# Altium schematic sheet ZOWI_Main_Board_Bluetooth.SchDoc: Bluetooth
size A3; Author: Raúl de Pablos; CompanyName: bq - Mundo Reader; Organization: bq - Mundo Reader; DocumentNumber: 7; Revision: 1.0; SheetNumber: 7; SheetTotal: 9; ProjectName: ZOWI_Main_Board
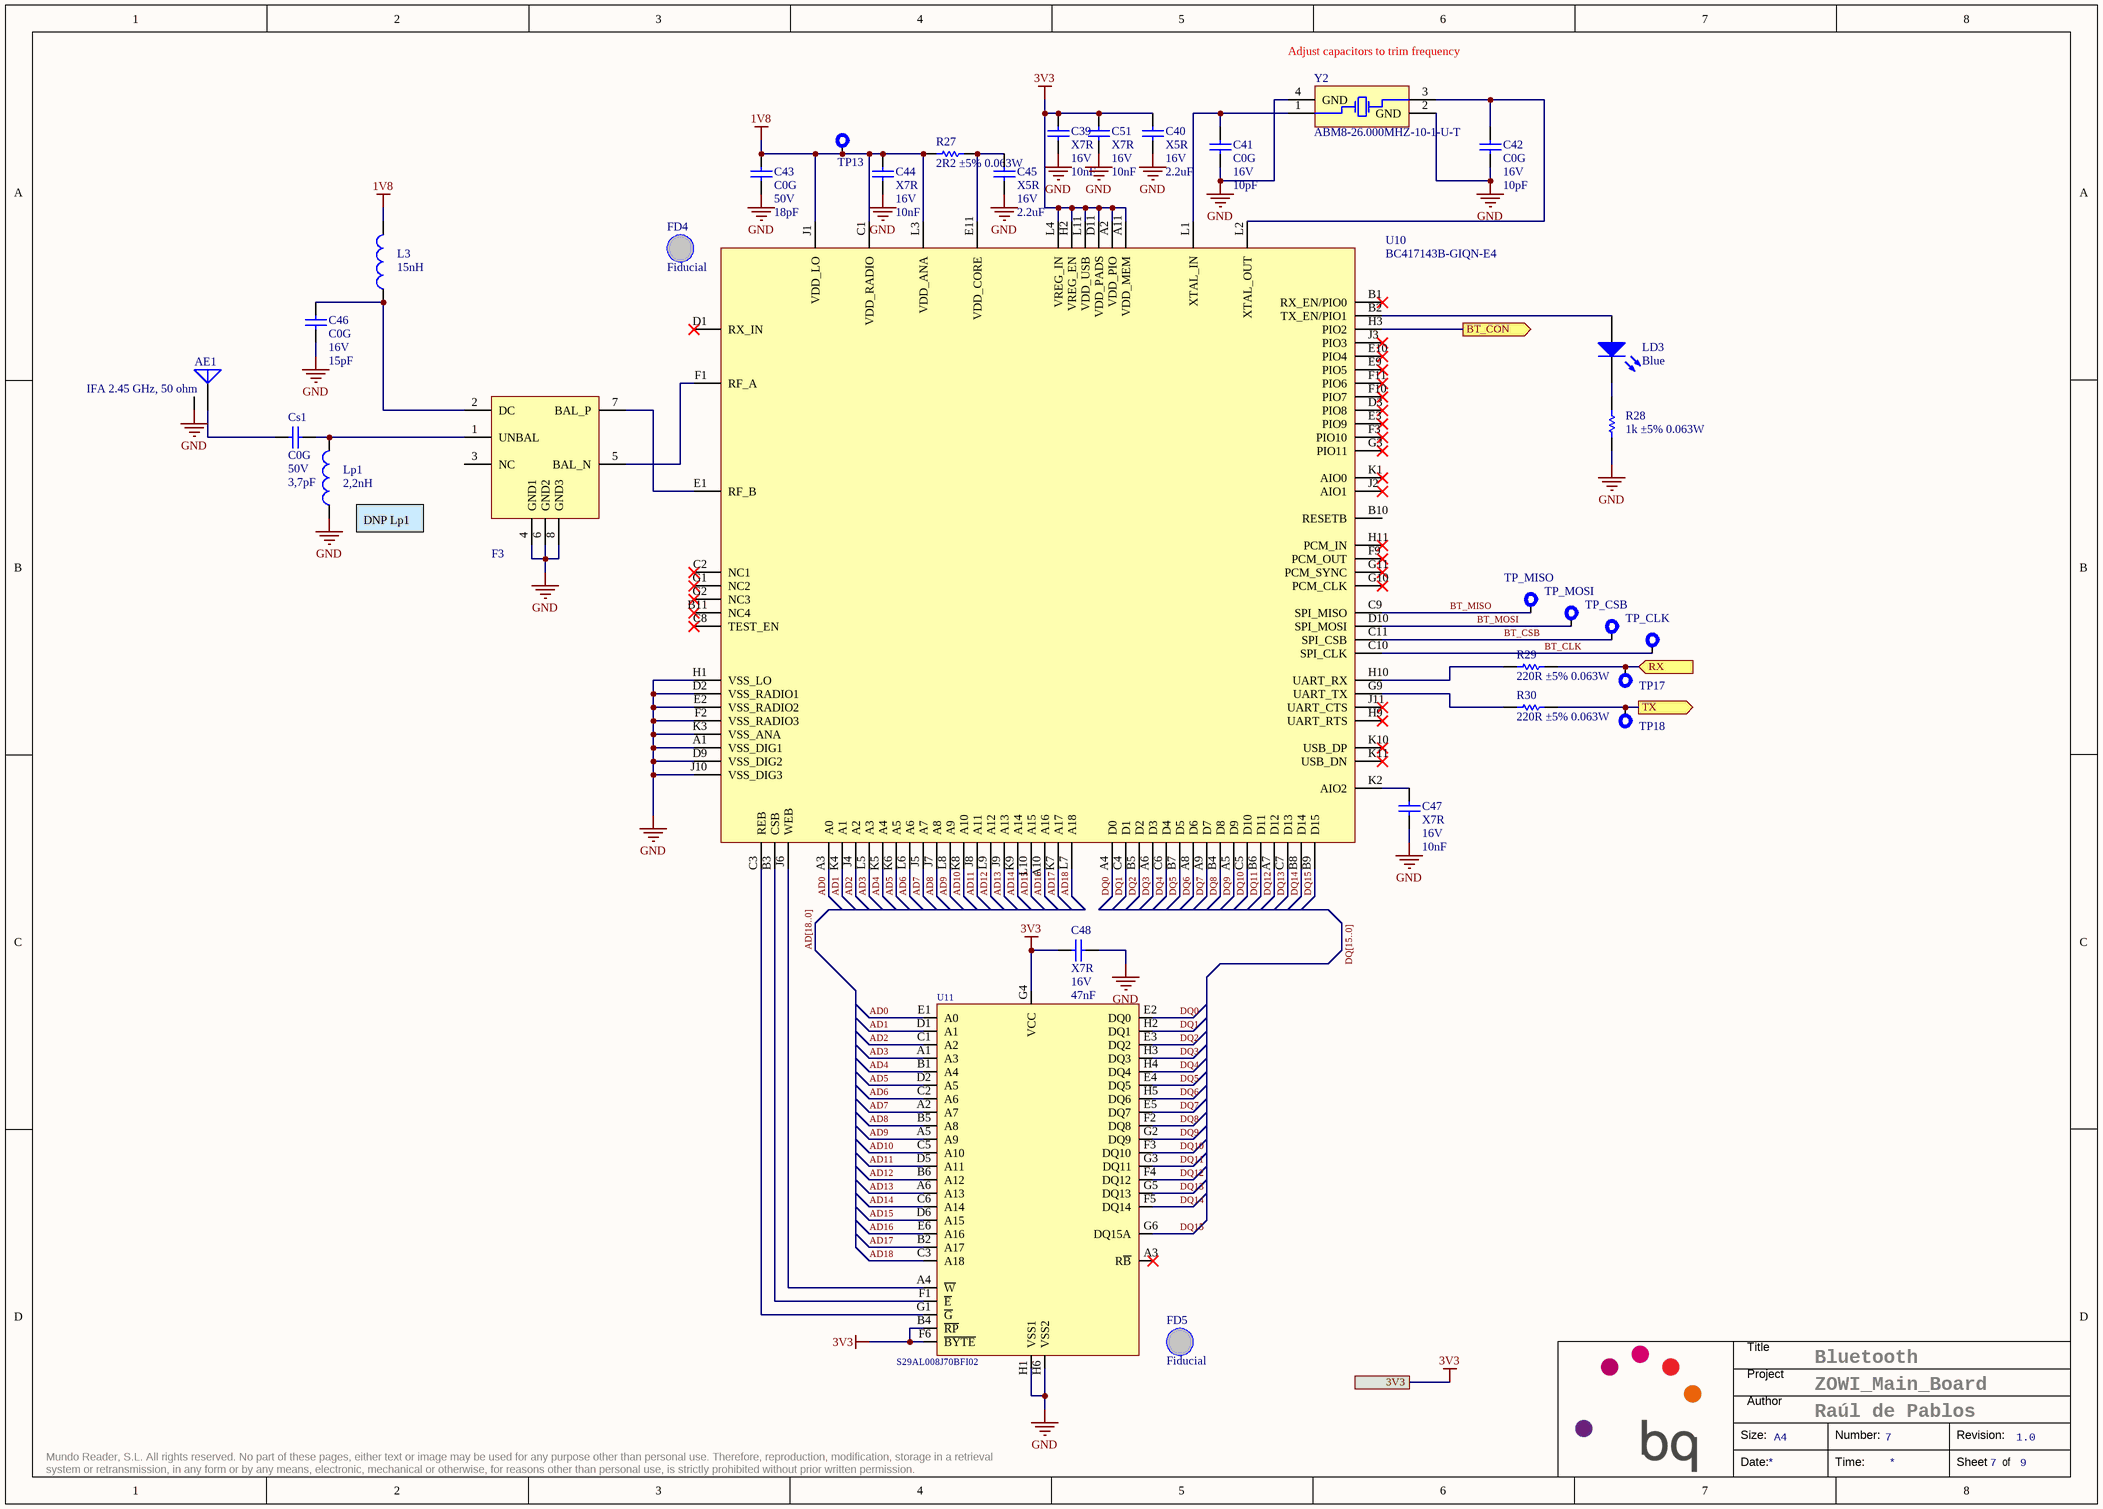
[diagram p0: ZOWI_Main_Board_Bluetooth.SchDoc]

## Parts
AE1  (no value)  [IFA_2,45GHZ_50OHM]  (no BOM)
C39  Dielectric: X7R  Voltage: 16V  Capacitance: 10nF  [C0402]  (hidden comment: Capacitor)
C40  Dielectric: X5R  Voltage: 16V  Capacitance: 2.2uF  [C0603]  (hidden comment: Capacitor)
C41  Dielectric: C0G  Voltage: 16V  Capacitance: 10pF  [C0402]  (hidden comment: Capacitor)
C42  Dielectric: C0G  Voltage: 16V  Capacitance: 10pF  [C0402]  (hidden comment: Capacitor)
C43  Dielectric: C0G  Voltage: 50V  Capacitance: 18pF  [C0402]  (hidden comment: Capacitor)
C44  Dielectric: X7R  Voltage: 16V  Capacitance: 10nF  [C0402]  (hidden comment: Capacitor)
C45  Dielectric: X5R  Voltage: 16V  Capacitance: 2.2uF  [C0603]  (hidden comment: Capacitor)
C46  Dielectric: C0G  Voltage: 16V  Capacitance: 15pF  [C0402]  (hidden comment: Capacitor)
C47  Dielectric: X7R  Voltage: 16V  Capacitance: 10nF  [C0402]  (hidden comment: Capacitor)
C48  Dielectric: X7R  Voltage: 16V  Capacitance: 47nF  [C0402]  (hidden comment: Capacitor)
C51  Dielectric: X7R  Voltage: 16V  Capacitance: 10nF  [C0402]  (hidden comment: Capacitor)
Cs1  Dielectric: C0G  Voltage: 50V  Capacitance: 3,7pF  [C0402]  (hidden comment: Capacitor)
F3  BP_Filter_Balun  [2450FB15K0005]  (value not drawn)
FD4  Fiducial  [Fiducial_Local_0.4mm]  (no BOM)
FD5  Fiducial  [Fiducial_Local_0.4mm]  (no BOM)
L3  L: 15nH  [L0402]
LD3  Blue  [LED0603]
Lp1  L: 2,2nH  [L0402]  (no BOM)
R27  value 2R2 ±5% 0.063W  [R0402]  (hidden comment: Resistor)
R28  value 1k ±5% 0.063W  [R0402]  (hidden comment: Resistor)
R29  value 220R ±5% 0.063W  [R0402]  (hidden comment: Resistor)
R30  value 220R ±5% 0.063W  [R0402]  (hidden comment: Resistor)
TP13  Testpoint  [TP_SMD_1mm]  (value not drawn)  (no BOM)
TP17  Testpoint  [TP_SMD_1mm]  (value not drawn)  (no BOM)
TP18  Testpoint  [TP_SMD_1mm]  (value not drawn)  (no BOM)
TP_CLK  Testpoint  [TP_SMD_1mm]  (value not drawn)  (no BOM)
TP_CSB  Testpoint  [TP_SMD_1mm]  (value not drawn)  (no BOM)
TP_MISO  Testpoint  [TP_SMD_1mm]  (value not drawn)  (no BOM)
TP_MOSI  Testpoint  [TP_SMD_1mm]  (value not drawn)  (no BOM)
U10  BC417143B-GIQN-E4  [TFBGA96P8X8]
U11  S29AL008J70BFI02  [TFBGA48P6X8]
Y2  ABM8-26.000MHZ-10-1-U-T  [XTAL 3.2x2.5]

## Ports
3V3, BT_CON (out), RX (in), TX (out)

## Nets
1V8: C43.2 C44.2 L3.2 R27.2 TP13.1 U10.C1(VDD_RADIO) U10.J1(VDD_LO) U10.L3(VDD_ANA)
3V3: C39.2 C40.2 C48.1 C51.2 U10.A2(VDD_PIO) U10.A11(VDD_MEM) U10.D11(VDD_PADS) U10.H2(VREG_EN) U10.L4(VREG_IN) U10.L11(VDD_USB) U11.B4(~{RP}) U11.F6(~{BYTE}) U11.G4(VCC) ; port 3V3
GND: AE1.GND C39.1 C40.1 C41.1 C42.1 C43.1 C44.1 C45.1 C46.1 C47.1 C48.2 C51.1 F3.4(GND1) F3.6(GND2) F3.8(GND3) Lp1.1 R28.1 U10.A1(VSS_DIG1) U10.D2(VSS_RADIO1) U10.D9(VSS_DIG2) U10.E2(VSS_RADIO2) U10.F2(VSS_RADIO3) U10.H1(VSS_LO) U10.J10(VSS_DIG3) U10.K3(VSS_ANA) U11.H1(VSS1) U11.H6(VSS2) Y2.2(GND) Y2.4(GND)
AD0: U10.A3(A0) U11.E1(A0)
AD1: U10.K4(A1) U11.D1(A1)
AD2: U10.J4(A2) U11.C1(A2)
AD3: U10.L5(A3) U11.A1(A3)
AD4: U10.K5(A4) U11.B1(A4)
AD5: U10.K6(A5) U11.D2(A5)
AD6: U10.L6(A6) U11.C2(A6)
AD7: U10.J5(A7) U11.A2(A7)
AD8: U10.J7(A8) U11.B5(A8)
AD9: U10.L8(A9) U11.A5(A9)
AD10: U10.K8(A10) U11.C5(A10)
AD11: U10.J8(A11) U11.D5(A11)
AD12: U10.L9(A12) U11.B6(A12)
AD13: U10.J9(A13) U11.A6(A13)
AD14: U10.K9(A14) U11.C6(A14)
AD15: U10.L10(A15) U11.D6(A15)
AD16: U10.A10(A16) U11.E6(A16)
AD17: U10.K7(A17) U11.B2(A17)
AD18: U10.L7(A18) U11.C3(A18)
BT_CLK: TP_CLK.1 U10.C10(SPI_CLK)
BT_CON: U10.H3(PIO2) ; port BT_CON
BT_CSB: TP_CSB.1 U10.C11(SPI_CSB)
BT_MISO: TP_MISO.1 U10.C9(SPI_MISO)
BT_MOSI: TP_MOSI.1 U10.D10(SPI_MOSI)
DQ0: U10.A4(D0) U11.E2(DQ0)
DQ1: U10.C4(D1) U11.H2(DQ1)
DQ2: U10.B5(D2) U11.E3(DQ2)
DQ3: U10.A6(D3) U11.H3(DQ3)
DQ4: U10.C6(D4) U11.H4(DQ4)
DQ5: U10.B7(D5) U11.E4(DQ5)
DQ6: U10.A8(D6) U11.H5(DQ6)
DQ7: U10.A9(D7) U11.E5(DQ7)
DQ8: U10.B4(D8) U11.F2(DQ8)
DQ9: U10.A5(D9) U11.G2(DQ9)
DQ10: U10.C5(D10) U11.F3(DQ10)
DQ11: U10.B6(D11) U11.G3(DQ11)
DQ12: U10.A7(D12) U11.F4(DQ12)
DQ13: U10.C7(D13) U11.G5(DQ13)
DQ14: U10.B8(D14) U11.F5(DQ14)
DQ15: U10.B9(D15) U11.G6(DQ15A)
RX: R29.2 TP17.1 ; port RX
TX: R30.2 TP18.1 ; port TX
NetAE1_FEED: AE1.FEED Cs1.1
NetC41_2: C41.2 U10.L1(XTAL_IN) Y2.1(OSC1)
NetC42_2: C42.2 U10.L2(XTAL_OUT) Y2.3(OSC2)
NetC45_2: C45.2 R27.1 U10.E11(VDD_CORE)
NetC46_2: C46.2 F3.2(DC) L3.1
NetC47_2: C47.2 U10.K2(AIO2)
NetCs1_2: Cs1.2 F3.1(UNBAL) Lp1.2
NetF3_5: F3.5(BAL_N) U10.F1(RF_A)
NetF3_7: F3.7(BAL_P) U10.E1(RF_B)
NetLD3_A: LD3.A U10.B2(TX_EN/PIO1)
NetLD3_K: LD3.K R28.2
NetR29_1: R29.1 U10.H10(UART_RX)
NetR30_1: R30.1 U10.G9(UART_TX)
NetU10_B3: U10.B3(CSB) U11.F1(~{E})
NetU10_C3: U10.C3(REB) U11.G1(~{G})
NetU10_J6: U10.J6(WEB) U11.A4(~{W})

Not connected (* = marked no-connect by the designer): F3 3(NC); U10 B1(RX_EN/PIO0)* B10(RESETB) B11(NC4)* C2(NC1)* C8(TEST_EN)* D1(RX_IN)* D3(PIO8)* E3(PIO9)* E9(PIO5)* E10(PIO4)* F3(PIO10)* F9(PCM_OUT)* F10(PIO7)* F11(PIO6)* G1(NC2)* G2(NC3)* G3(PIO11)* G10(PCM_CLK)* G11(PCM_SYNC)* H9(UART_RTS)* H11(PCM_IN)* J2(AIO1)* J3(PIO3)* J11(UART_CTS)* K1(AIO0)* K10(USB_DP)* K11(USB_DN)*; U11 A3(R~{B})*

## Buses and harness runs
bus AD[18..0]
bus DQ[15..0]

## Notes on the sheet
- (near Y2) Adjust capacitors to trim frequency
- (near AE1) IFA 2.45 GHz, 50 ohm
- (near Lp1) DNP Lp1
- Title
- Project
- Size:
- Author
- A4
- Number:
- Revision:
- Mundo Reader, S.L. All rights reserved. No part of these pages, either text or image may be used for any purpose other than personal use. Therefore, reproduction, modification, storage in a retrieval system or retransmission, in any form or by any means, electronic, mechanical or otherwise, for reasons other than personal use, is strictly prohibited without prior written permission.
- Date:
- Time:
- Sheet
- of

## Library data of the parts
AE1 = Microstrip_2.4GHz: Antenna with Ground; Value: 2,4GHz; Part Number: Microstrip_2.4GHz
C39 C44 C47 C51 = C0402_10nF_16V_±10%: Capacitor SMD; Manufacturer: Kemet; Value: 10nF ±10% 16V; Tolerance: ±10%; OrderingCode: C0402C103K4RAC; Temp_ Max: 125; Temp_ Min: -55; Part Number: C0402_10nF_16V_±10%
C40 C45 = C0603_2.2uF_16V_±10%: Capacitor SMD; Manufacturer: Kemet; Value: 2.2uF ±10% 16V; Tolerance: ±10%; OrderingCode: C0603C225K4PAC; Temp_ Max: 125; Temp_ Min: -55; Part Number: C0603_2.2uF_16V_±10%
C41 C42 = C0402_10pF_16V_±10%: Capacitor SMD; Manufacturer: Kemet; Value: 10pF ±10% 16V; Tolerance: ±10%; OrderingCode: C0402C100K4GAC; Temp_ Max: 125; Temp_ Min: -55; Part Number: C0402_10pF_16V_±10%
C43 = C0402_18pF_50V_±5%: Capacitor SMD; Manufacturer: Murata; Value: 18pF ±5% 50V; Tolerance: ±5%; OrderingCode: GRM1555C1H180JA01D; Temp_ Max: 125; Temp_ Min: -55; Part Number: C0402_18pF_50V_±5%
C46 = C0402_15pF_16V_±10%: Capacitor SMD; Manufacturer: Kemet; Value: 15pF ±10% 16V; Tolerance: ±10%; OrderingCode: C0402C150K4GAC; Temp_ Max: 125; Temp_ Min: -55; Part Number: C0402_15pF_16V_±10%
C48 = C0402_47nF_16V_±10%: Capacitor SMD; Manufacturer: Kemet; Value: 47nF ±10% 16V; Tolerance: ±10%; OrderingCode: C0402C473K4RAC; Temp_ Max: 125; Temp_ Min: -55; Part Number: C0402_47nF_16V_±10%
Cs1 = C0402_3,7pF_50V_±7%: Capacitor SMD; Part Number: C0402_3,7pF_50V_±0.05pF; Manufacturer: Murata; Value: 3,7pF ±7% 50V; Tolerance: ±7%; OrderingCode: GJM1555C1H3R7WB01D; Temp_ Max: 125; Temp_ Min: -55
F3 = BP_Filter_Balun: Filter, Band Pass, Balun; Manufacturer: Johanson Technlogy; OrderingCode: 2450FB15K0005E; Temp_ Max: 85; Temp_ Min: -40; OrderingCode 2: DBF81F104-CSR-T; Part Number: BP_Filter_Balun; Manufacturer 2: Soshin
FD4 FD5 = Fiducial Local 0.4mm: Fiducial Mark; Part Number: Fiducial Local 0.4mm
L3 = 15nH_0,3A: Inductor SMD; Manufacturer: Murata; Rdc: 0,320R; Current: 0,3A; Current Sat#: 5,72A; OrderingCode: LQG15HS15NJ02D; Temp_ Max: 125; Temp_ Min: -55; Value: 15nH 0,3A; Part Number: 15nH_0,3A
LD3 = LTST-C194TBKT: LED; Manufacturer: Lite-On; Temp_ Max: 80; Temp_ Min: -20; OrderingCode 2: HSMN-C120; Part Number: LTST-C194TBKT; OrderingCode: LTST-C194TBKT; Manufacturer 2: Avago Technologies; Value: Blue
Lp1 = 3nH_0,3A: Inductor SMD; Part Number: 2,2nH_0,9A; Manufacturer: Murata; Rdc: 0,17R; Current: 0,9A; Current Sat#: 5,72A; OrderingCode: LQW15AN2N2B80D; Temp_ Max: 125; Temp_ Min: -55; Value: 2,2nH 0,9A
R27 = R0402_2R2_0.063W_±5%: Resistor, SMD; Manufacturer: Vishay; Tolerance: ±5%; OrderingCode: CRCW04022R20JN; Power: 0.063W; Resistance: 2R2; Temp_ Max: 155; Temp_ Min: -55; PackageDescription: SMD; Part Number: R0402_2R2_0.063W_±5%
R28 = R0402_1k_0.063W_±5%: Resistor, SMD; Manufacturer: Vishay; Tolerance: ±5%; OrderingCode: CRCW04021K00JN; Power: 0.063W; Resistance: 1k; Temp_ Max: 155; Temp_ Min: -55; PackageDescription: SMD; Part Number: R0402_1k_0.063W_±5%
R29 R30 = R0402_220R_0.063W_±5%: Resistor, SMD; Manufacturer: Vishay; Tolerance: ±5%; OrderingCode: CRCW0402220RJN; Power: 0.063W; Resistance: 220R; Temp_ Max: 155; Temp_ Min: -55; PackageDescription: SMD; Part Number: R0402_220R_0.063W_±5%
TP13 TP17 TP18 TP_CLK TP_CSB TP_MISO TP_MOSI = TP_SMD_1mm: Manufacturer: Oxley; OrderingCode: SMOX/060/B1; SAP: 303552; Part Number: TP_SMD_1mm
U10 = BlueCore4-EXT: Bluetooth Modem, 2.4-GHz Bluetooth SoC; Manufacturer: CSR; Temp_ Max: 105; Temp_ Min: -40; Part Number: BlueCore4-EXT; OrderingCode: BC417143B-GIQN-E4
U11 = M29W800DT: Memory NOR Flash 8-Mbit 3 V supply; Manufacturer: Spansion; Temp_ Max: 125; Temp_ Min: -50; Value: 8MB; OrderingCode 2: M29W800DB70ZE6E; OrderingCode 3: MX29LV800CBXEI-70G; Part Number: M29W800DT; OrderingCode: S29AL008J70BFI02; Manufacturer 2: Micron; Manufacturer 3: Macronix
Y2 = 403C11A 26MHz: Crystal 4 pin; Manufacturer: Abracon; Tolerance: ±10ppm; Load Capacitance: 10pF; Temp_ Max: 70; Temp_ Min: -20; OrderingCode 2: 403C11A26M00000; Value: 26MHz; Part Number: 403C11A 26MHz; OrderingCode: ABM8-26.000MHZ-10-1-U-T; Manufacturer 2: CTS